# Altium project UHAL_BMP280_SPI.PrjPcb
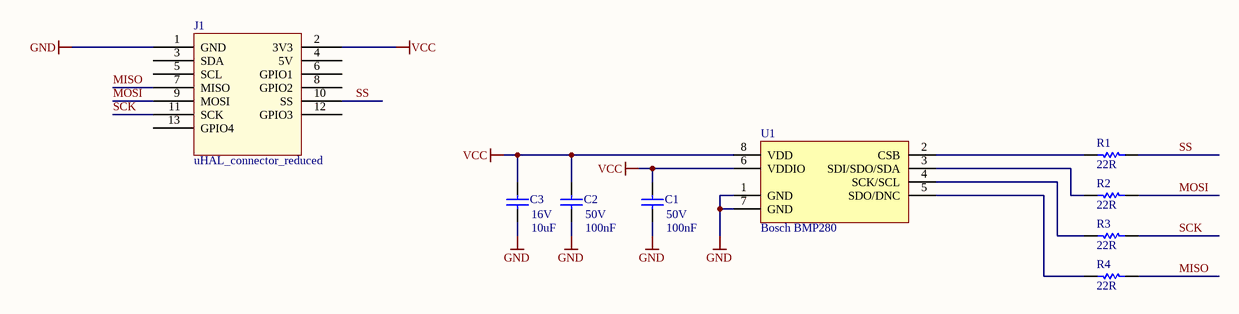
[diagram p0: bmp280_spi.SchDoc]
1 sheet, 9 parts. Net scope: global (net labels, ports and power ports of the same name join across sheets).

## Sheet bmp280_spi.SchDoc
size A4

### Parts
C1  Capacitance: 100nF  Voltage Rating (DC): 50V  [CAPC1608X90X35ML10T15]  (hidden comment: Murata GCM188R71H104KA57D)
C2  Capacitance: 100nF  Voltage Rating (DC): 50V  [CAPC1608X90X35ML10T15]  (hidden comment: Murata GCM188R71H104KA57D)
C3  Capacitance: 10uF  Voltage Rating (DC): 16V  [CAPC1608X90X35ML10T15]
J1  uHAL_connector_reduced  [PCB-45ncoppm4oopozvqifsq-1]
R1  22R  [RESC1608X05N]
R2  22R  [RESC1608X05N]
R3  22R  [RESC1608X05N]
R4  22R  [RESC1608X05N]
U1  Bosch BMP280  [PCB-7ktgzhb423iat7xn8psi-1]

### Nets
GND: C1.2 C2.2 C3.2 J1.1(GND) U1.1(GND) U1.7(GND)
VCC: C1.1 C2.1 C3.1 J1.2(3V3) U1.6(VDDIO) U1.8(VDD)
MISO: J1.7(MISO) R4.1
MOSI: J1.9(MOSI) R2.1
SCK: J1.11(SCK) R3.1
SS: J1.10(SS) R1.1
NetR1_2: R1.2 U1.2(CSB)
NetR2_2: R2.2 U1.3(SDI/SDO/SDA)
NetR3_2: R3.2 U1.4(SCK/SCL)
NetR4_2: R4.2 U1.5(SDO/DNC)

Not connected (* = marked no-connect by the designer): J1 3(SDA) 4(5V) 5(SCL) 6(GPIO1) 8(GPIO2) 12(GPIO3) 13(GPIO4)

### Library data of the parts
C1 C2 = CMP-119667-3: CAP CER 0.1UF 50V 10% X7R 0603; Lead-Free Status: Lead Free; Capacitance Tolerance: ±10%; Dielectric Characteristic: X7R; Octopart Url: https://octopart.com/gcm188r71h104ka57d-murata-7894792; OctopartID: 3480fdf266eeeb47; Packaging: Cut Tape (CT); REACH SVHC Compliance: No SVHC; RoHS: Compliant
C3 = CMP-119667-3: Dielectric Characteristic: X7R
J1 = CMP-2q23h2cwhjlfm8s6r7i8-1: connector for uHAL with reduced pin number; CustomComponentID: 2q23h2cwhjlfm8s6r7i8
R1-R4 = CMP-31acf99032f6ee6b-1: Power Rating: 0.1W; Case/Package: 0603, 1608; Value: 22R
U1 = CMP-15503767-8: P-Sensor SPI I2C SMD; RoHS: Compliant; Manufacturer Part Number: BMP280; Octopart URL: https://octopart.com/bmp280-bosch+tools-26451306; OctopartID: f1e0397949ec2e27